# Altium project iono_pico.PrjPcb
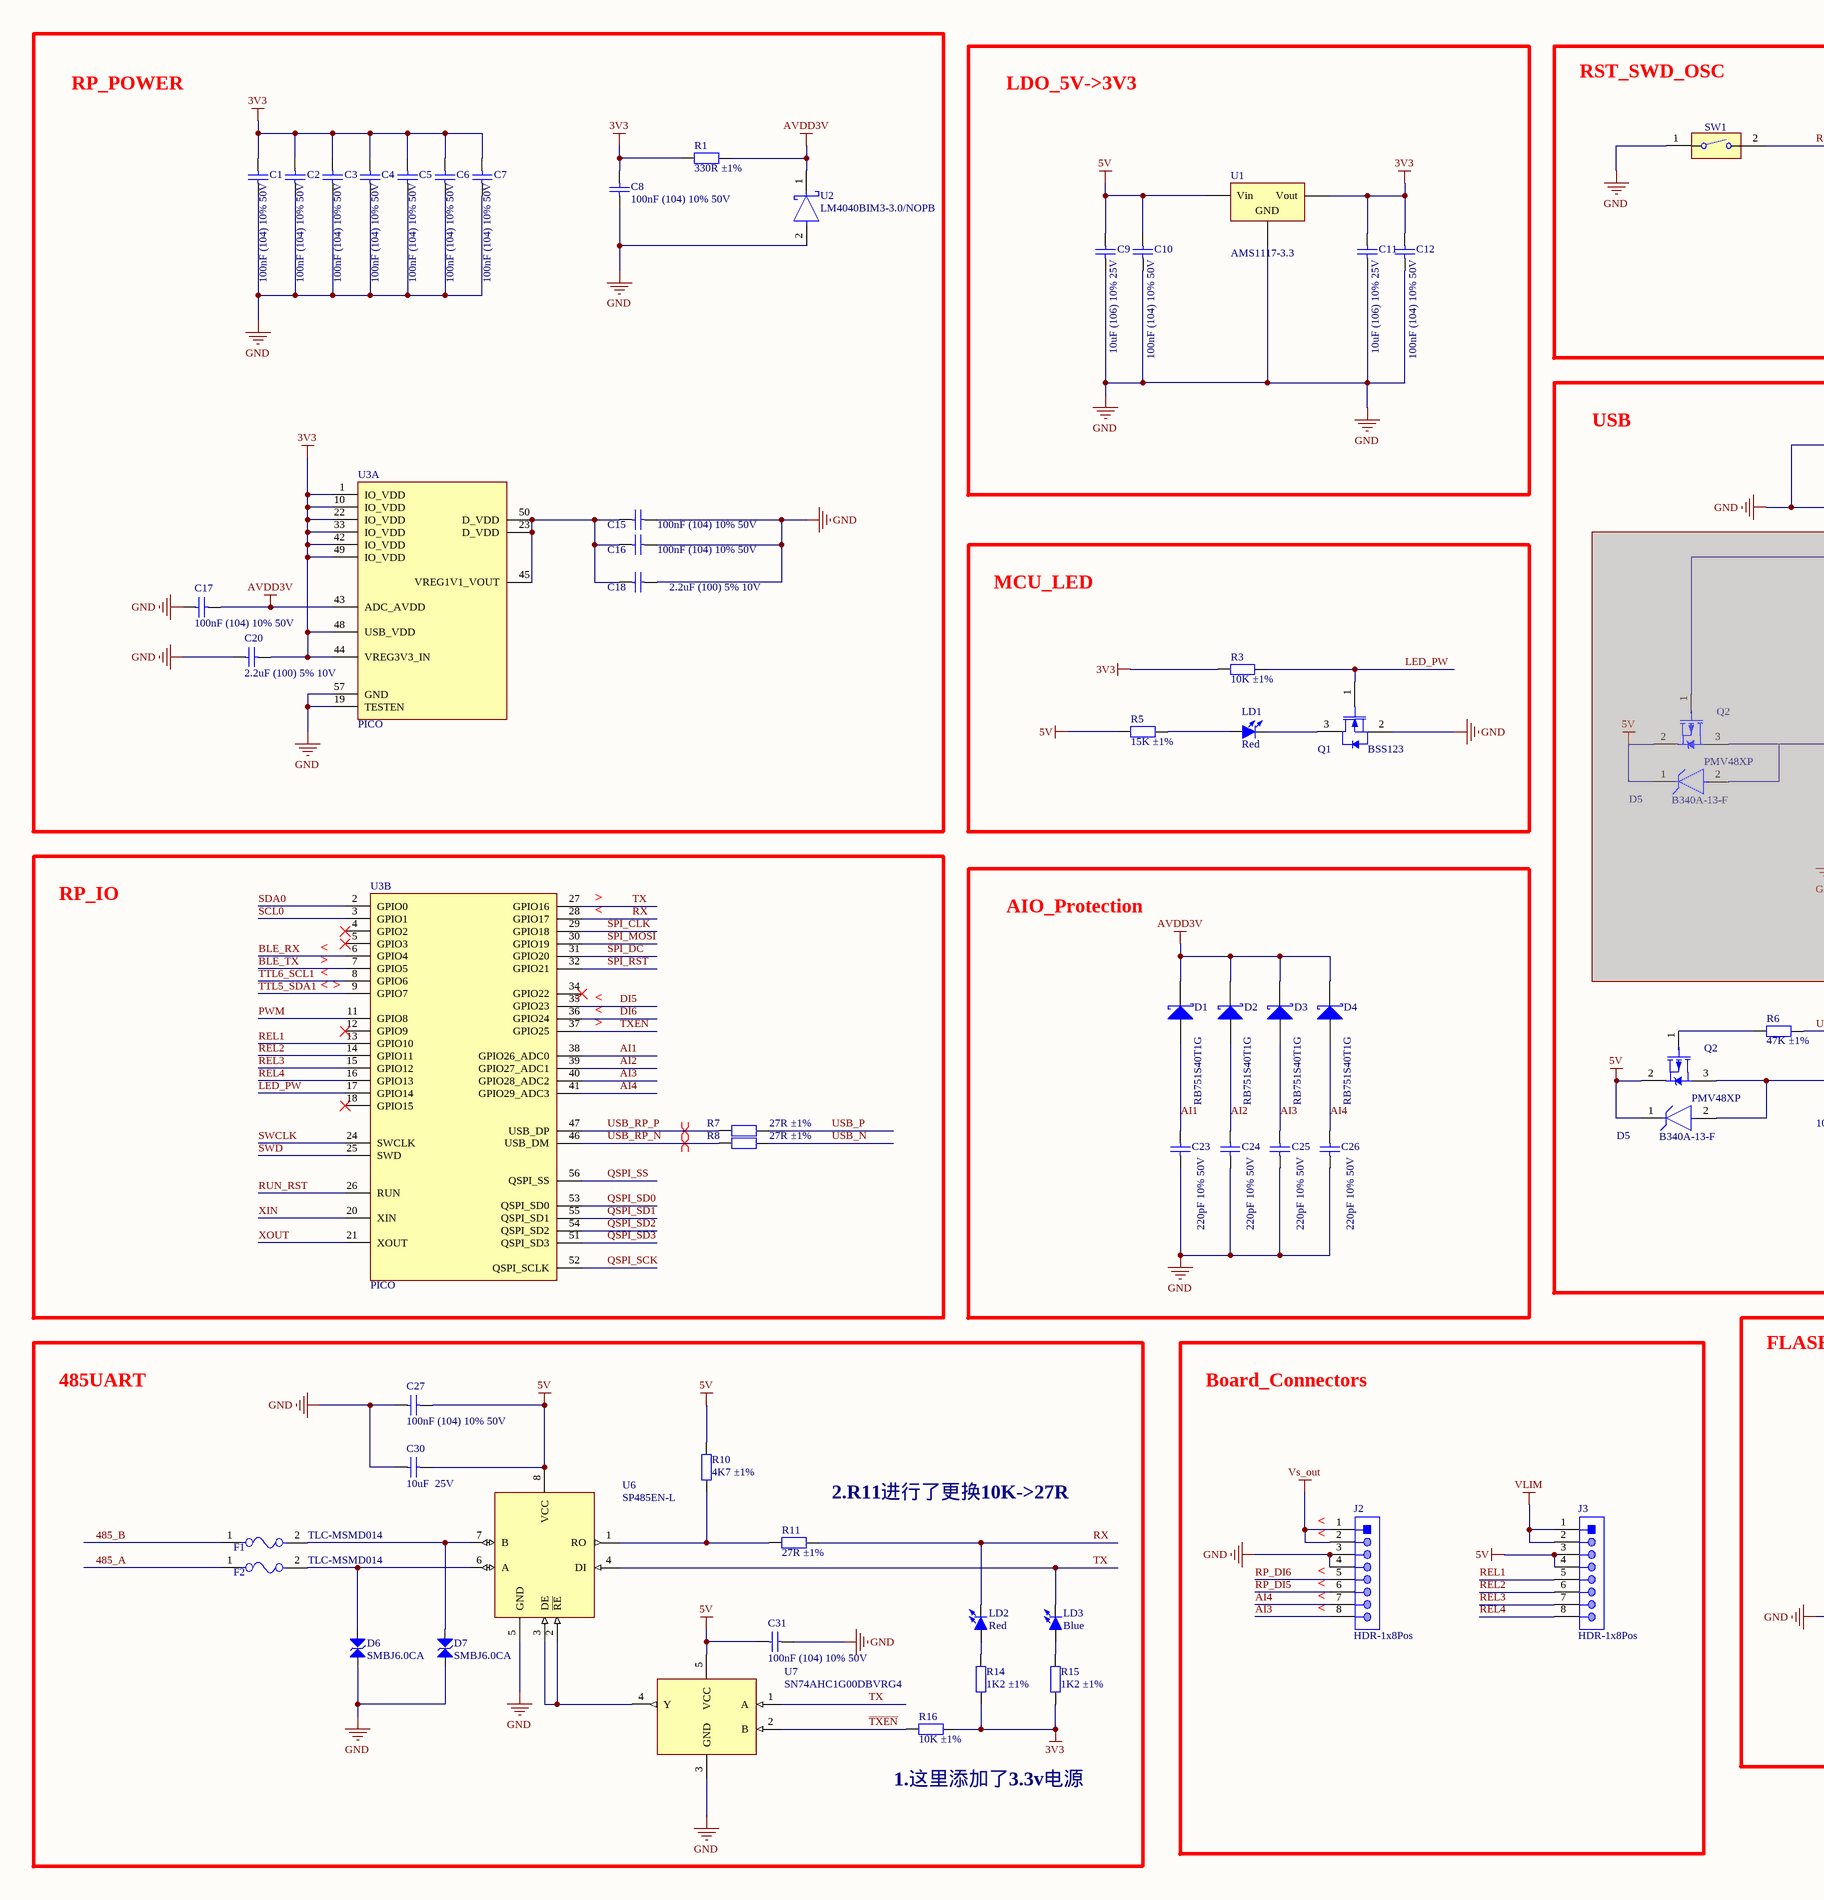
[diagram p0: core.SchDoc, left]
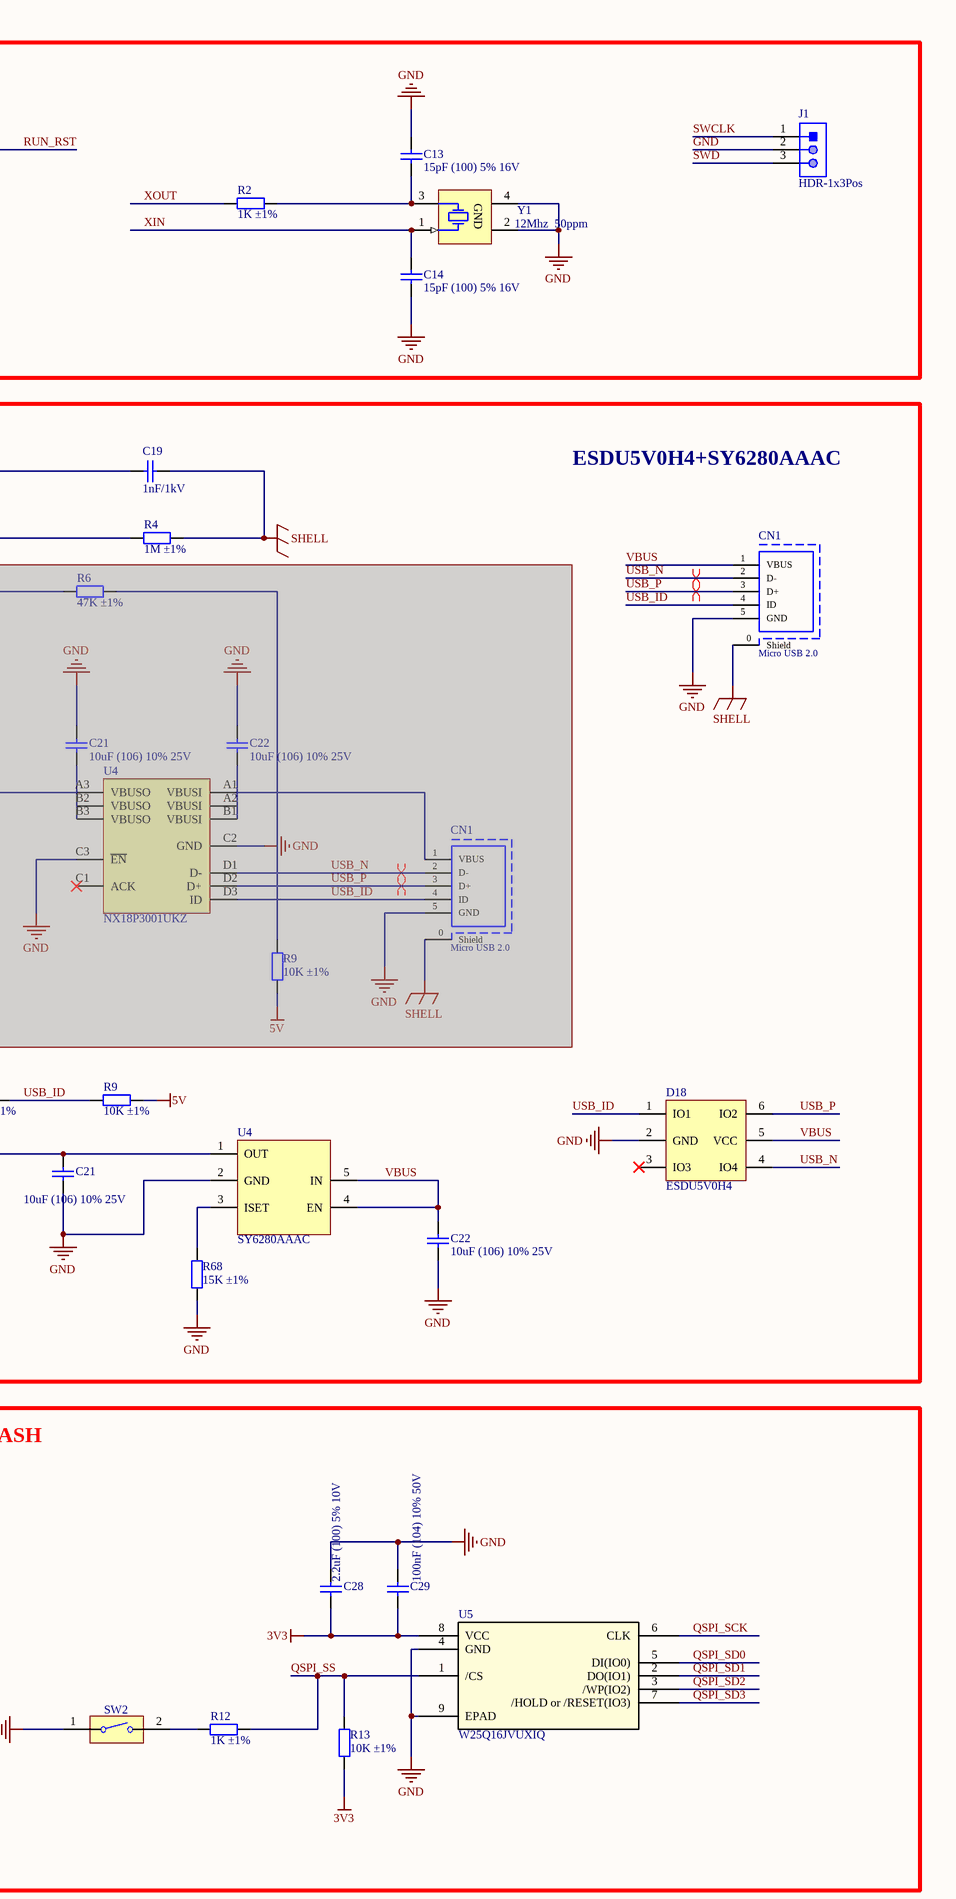
[diagram p1: core.SchDoc, right]
2 sheets, 183 parts. Net scope: global (net labels, ports and power ports of the same name join across sheets).
Board file: iono_pico.PcbDoc
Sheets:
  core.SchDoc
  device.SchDoc

## Sheet core.SchDoc
size A2

### Parts
(Parts that share a designator on the sheet are numbered #1, #2 ... from top to bottom, then left to right.)
C1  100nF (104) 10% 50V  [0402_C]
C2  100nF (104) 10% 50V  [0402_C]
C3  100nF (104) 10% 50V  [0402_C]
C4  100nF (104) 10% 50V  [0402_C]
C5  100nF (104) 10% 50V  [0402_C]
C6  100nF (104) 10% 50V  [0402_C]
C7  100nF (104) 10% 50V  [0402_C]
C8  100nF (104) 10% 50V  [0402_C]
C9  10uF (106) 10% 25V  [0603_C]
C10  100nF (104) 10% 50V  [0402_C]
C11  10uF (106) 10% 25V  [0603_C]
C12  100nF (104) 10% 50V  [0402_C]
C13  15pF (100) 5% 16V  [0402_C]
C14  15pF (100) 5% 16V  [0402_C]
C15  100nF (104) 10% 50V  [0402_C]
C16  100nF (104) 10% 50V  [0402_C]
C17  100nF (104) 10% 50V  [0402_C]
C18  2.2uF (100) 5% 10V  [0603_C]
C19  1nF/1kV  [0805_C]
C20  2.2uF (100) 5% 10V  [0603_C]
C21#1  10uF (106) 10% 25V  [0603_C]  (masked out: inside a compile mask, not in the netlist)
C21#2  10uF (106) 10% 25V  [0603_C]
C22#1  10uF (106) 10% 25V  [0603_C]  (masked out: inside a compile mask, not in the netlist)
C22#2  10uF (106) 10% 25V  [0603_C]
C23  220pF 10% 50V  [0402_C]
C24  220pF 10% 50V  [0402_C]
C25  220pF 10% 50V  [0402_C]
C26  220pF 10% 50V  [0402_C]
C27  100nF (104) 10% 50V  [0402_C]
C28  2.2uF (100) 5% 10V  [0603_C]
C29  100nF (104) 10% 50V  [0402_C]
C30  10uF  25V  [0603_C]
C31  100nF (104) 10% 50V  [0402_C]
CN1#1  Micro USB 2.0  [USB-MICRO-A]
CN1#2  Micro USB 2.0  [USB-MICRO-A]  (masked out: inside a compile mask, not in the netlist)
D1  RB751S40T1G  [SOD-523]
D2  RB751S40T1G  [SOD-523]
D3  RB751S40T1G  [SOD-523]
D4  RB751S40T1G  [SOD-523]
D5#1  B340A-13-F  [DO-214AC]  (masked out: inside a compile mask, not in the netlist)
D5#2  B340A-13-F  [DO-214AC]
D6  SMBJ6.0CA  [DO-214AA]
D7  SMBJ6.0CA  [DO-214AA]
D18  ESDU5V0H4  [SOT23-6]
F1  TLC-MSMD014  [1812_R]
F2  TLC-MSMD014  [1812_R]
J1  HDR-1x3Pos  [HDR-2.54-1x3-V]
J2  HDR-1x8Pos  [Pin Header 1x8 TH Pitch 2.54mm]
J3  HDR-1x8Pos  [Pin Header 1x8 TH Pitch 2.54mm]
LD1  Red  [0603_LED]
LD2  Red  [0603_LED]
LD3  Blue  [0603_LED]
Q1  BSS123  [SOT95P245X110-3N]
Q2#1  PMV48XP  [SOT-23-3]  (masked out: inside a compile mask, not in the netlist)
Q2#2  PMV48XP  [SOT-23-3]
R1  330R ±1%  [0402_R]
R2  1K ±1%  [0402_R]
R3  10K ±1%  [0402_R]
R4  1M ±1%  [0805_R]
R5  15K ±1%  [0402_R]
R6#1  47K ±1%  [0402_R]  (masked out: inside a compile mask, not in the netlist)
R6#2  47K ±1%  [0402_R]
R7  27R ±1%  [0402_R]
R8  27R ±1%  [0402_R]
R9#1  10K ±1%  [0402_R]  (masked out: inside a compile mask, not in the netlist)
R9#2  10K ±1%  [0402_R]
R10  4K7 ±1%  [0402_R]
R11  27R ±1%  [0402_R]
R12  1K ±1%  [0402_R]
R13  10K ±1%  [0402_R]
R14  1K2 ±1%  [0402_R]
R15  1K2 ±1%  [0402_R]
R16  10K ±1%  [0402_R]
R68  15K ±1%  [0402_R]
SW1  (no value)  [KEY-SMD_L6.1-W3.7-LS8.0]
SW2  (no value)  [KEY-SMD_L6.1-W3.7-LS8.0]
U1  AMS1117-3.3  [SOT-223]
U2  LM4040BIM3-3.0/NOPB  [SOT23]
U3  PICO  [RP2040]  (parts A,B of 2)
U4#1  NX18P3001UKZ  [WLCSP12]  (masked out: inside a compile mask, not in the netlist)
U4#2  SY6280AAAC  [SOT-23-5]
U5  W25Q16JVUXIQ  [W25Q16JVUXIQ_WIN]
U6  SP485EN-L  [SOIC8]
U7  SN74AHC1G00DBVRG4  [SOT-23-5]
Y1  12Mhz  50ppm  [OSC_SI-TIME_SIT1602-2]

### Blocks framed on the sheet
RP_POWER: C1-C8 C15-C18 C20 R1 U2 U3
LDO_5V->3V3: C9-C12 U1
RST_SWD_OSC: C13 C14 J1 R2 SW1 Y1
MCU_LED: LD1 Q1 R3 R5
RP_IO: R7 R8 U3
AIO_Protection: C23-C26 D1-D4
Board_Connectors: J2 J3
FLASH: C28 C29 R12 R13 SW2 U5

### Nets
3V3: C1.2 C2.2 C3.2 C4.2 C5.2 C6.2 C7.2 C8.2 C11.2 C12.2 C20.1 C28.2 C29.1 R1.1 R3.1 R13.1 R14.2 R15.2 R16.1 U1.2(Vout) U3.1(IO_VDD) U3.10(IO_VDD) U3.22(IO_VDD) U3.33(IO_VDD) U3.42(IO_VDD) U3.44(VREG3V3_IN) U3.48(USB_VDD) U3.49(IO_VDD) U5.8(VCC)
5V: C9.2 C10.2 C27.1 C30.2 C31.2 D5#2.1(C) J3.3 J3.4 Q2#2.2(S) R5.1 R9#2.1 R10.2 U1.3(Vin) U6.8(VCC) U7.5(VCC)
AVDD3V: C17.1 D1.1(K) D2.1(K) D3.1(K) D4.1(K) R1.2 U2.1 U3.43(ADC_AVDD)
GND: C1.1 C2.1 C3.1 C4.1 C5.1 C6.1 C7.1 C8.1 C9.1 C10.1 C11.1 C12.1 C13.2 C14.1 C15.2 C16.2 C17.2 C18.1 C19.1 C20.2 C21#2.1 C22#2.1 C23.1 C24.1 C25.1 C26.1 C27.2 C28.1 C29.2 C30.1 C31.1 CN1#1.5(GND) D6.2 D7.2 D18.2(GND) J1.2 J2.3 J2.4 Q1.2(SOURCE) R4.2 R68.1 SW1.1 SW2.1 U1.1(GND) U2.2 U3.19(TESTEN) U3.57(GND) U4#2.2(GND) U5.4(GND) U5.9(EPAD) U6.5(GND) U7.3(GND) Y1.2(GND) Y1.4(GND)
SHELL: C19.2 CN1#1.0(Shield) R4.1
VLIM: J3.1 J3.2
Vs_out: J2.1 J2.2
485_A: F2.1
485_B: F1.1
~{TXEN}: R16.2 U3.37(GPIO25) U7.2(B)
AI1: C23.2 D1.2(A) U3.38(GPIO26_ADC0)
AI2: C24.2 D2.2(A) U3.39(GPIO27_ADC1)
AI3: C25.2 D3.2(A) J2.8 U3.40(GPIO28_ADC2)
AI4: C26.2 D4.2(A) J2.7 U3.41(GPIO29_ADC3)
BLE_RX: U3.6(GPIO4)
BLE_TX: U3.7(GPIO5)
DI5: U3.35(GPIO23)
DI6: U3.36(GPIO24)
LED_PW: Q1.1(GATE) R3.2 U3.17(GPIO14)
PWM: U3.11(GPIO8)
QSPI_SCK: U3.52(QSPI_SCLK) U5.6(CLK)
QSPI_SD0: U3.53(QSPI_SD0) U5.5(DI(IO0))
QSPI_SD1: U3.55(QSPI_SD1) U5.2(DO(IO1))
QSPI_SD2: U3.54(QSPI_SD2) U5.3(/WP(IO2))
QSPI_SD3: U3.51(QSPI_SD3) U5.7(/HOLD_or_/RESET(IO3))
QSPI_SS: R12.1 R13.2 U3.56(QSPI_SS) U5.1(/CS)
REL1: J3.5 U3.13(GPIO10)
REL2: J3.6 U3.14(GPIO11)
REL3: J3.7 U3.15(GPIO12)
REL4: J3.8 U3.16(GPIO13)
RP_DI5: J2.6
RP_DI6: J2.5
RUN_RST: SW1.2 U3.26(RUN)
RX: LD2.2(K) R11.1 U3.28(GPIO17)
SCL0: U3.3(GPIO1)
SDA0: U3.2(GPIO0)
SPI_CLK: U3.29(GPIO18)
SPI_DC: U3.31(GPIO20)
SPI_MOSI: U3.30(GPIO19)
SPI_RST: U3.32(GPIO21)
SWCLK: J1.1 U3.24(SWCLK)
SWD: J1.3 U3.25(SWD)
TTL5_SDA1: U3.9(GPIO7)
TTL6_SCL1: U3.8(GPIO6)
TX: LD3.2(K) U3.27(GPIO16) U6.4(DI) U7.1(A)
USB_ID: CN1#1.4(ID) D18.1(IO1) R6#2.1 R9#2.2
USB_N: CN1#1.2(D-) D18.4(IO4) R8.2
USB_P: CN1#1.3(D+) D18.6(IO2) R7.2
USB_RP_N: R8.1 U3.46(USB_DM)
USB_RP_P: R7.1 U3.47(USB_DP)
VBUS: C22#2.2 CN1#1.1(VBUS) D18.5(VCC) U4#2.4(EN) U4#2.5(IN)
XIN: C14.2 U3.20(XIN) Y1.1(X)
XOUT: R2.1 U3.21(XOUT)
NetC13_1: C13.1 R2.2 Y1.3(X)
NetC15_1: C15.1 C16.1 C18.2 U3.23(D_VDD) U3.45(VREG1V1_VOUT) U3.50(D_VDD)
NetC21#2_2: C21#2.2 D5#2.2(A) Q2#2.3(D) U4#2.1(OUT)
NetD6_1: D6.1 F2.2 U6.6(A)
NetD7_1: D7.1 F1.2 U6.7(B)
NetLD1_1: LD1.1(A) R5.2
NetLD1_2: LD1.2(K) Q1.3(DRAIN)
NetLD2_1: LD2.1(A) R14.1
NetLD3_1: LD3.1(A) R15.1
NetQ2#2_1: Q2#2.1(G) R6#2.2
NetR10_1: R10.1 R11.2 U6.1(RO)
NetR12_2: R12.2 SW2.2
NetR68_2: R68.2 U4#2.3(ISET)
NetU6_2: U6.2(~{RE}) U6.3(DE) U7.4(Y)

Not connected (* = marked no-connect by the designer): D18 3(IO3)*; U3 4(GPIO2)* 5(GPIO3)* 12(GPIO9)* 18(GPIO15)* 34(GPIO22)*

### Layout directives
differential pair: (no net found under the mark), USB_N, USB_P, USB_RP_N, USB_RP_P

### Notes on the sheet
- USB
- ESDU5V0H4+SY6280AAAC
- (near U3) <
- (near U3) >
- 485UART
- (near R11) 2.R11进行了更换10K->27R
- (near J2) <
- (near R16) 1.这里添加了3.3v电源

### Library data of the parts
C1-C8 C10 C12 C15-C17 C27 C29 C31 = 0402 100nF (104) 10% 16V: 贴片电容; ComponentLink1Description: 供应商链接; ComponentLink1URL: http://www.szlcsc.com/product/details_1877.html; Package: 0402; Supplier: LC; SuppliersPartNumber: C1525
C9 C11 C21#1 C21#2 C22#1 C22#2 = 0603 10uF (106) 10% 10V: 贴片电容; ComponentLink1Description: 供应商链接; ComponentLink1URL: http://www.szlcsc.com/product/details_20411.html; Package: 0603; Supplier: LC; SuppliersPartNumber: C19702
C13 C14 = 0402 10pF (100) 5% 50V: 贴片电容; ComponentLink1Description: 供应商链接; ComponentLink1URL: http://www.szlcsc.com/product/details_33914.html; Package: 0402; Supplier: LC; SuppliersPartNumber: C32949
C18 C20 C28 C30 = 0603 10pF (100) 5% 50V: 贴片电容; ComponentLink1Description: 供应商链接; ComponentLink1URL: http://www.szlcsc.com/product/details_1986.html; Package: 0603; Supplier: LC; SuppliersPartNumber: C1634
C19 = 0603 1.5nF (152) 10% 50V: 贴片电容; ComponentLink1Description: 供应商链接; ComponentLink1URL: http://www.szlcsc.com/product/details_1947.html; Package: 0603; Supplier: LC; SuppliersPartNumber: C1595
C23-C26 = 0402 150pF (151) 10% 50V: 贴片电容; ComponentLink1Description: 供应商链接; ComponentLink1URL: http://www.szlcsc.com/product/details_1879.html; Package: 0402; Supplier: LC; SuppliersPartNumber: C1527
CN1#1 CN1#2 = Micro-USB2.0-2: Micro USB 2.0 Type AB Receptacle WR-COM, Horizontal, SMT; Part Number: 629105150921; Manufacturer: Wurth Elektronik; Rated Current: 1.8A; Contact Resistance: 30mOhm; Working Voltage: 30VAC; Publisher: WurthElektronik; Operating Temperature: -40to85degC; Gender: Receptacle; Packaging: TapeandReel; Connector Type: MicroUSB2.0TypeAB; Datasheet URL: https://katalog.we-online.de/em/datasheet/629105150921.pdf; Mounting Technology: SMT; Orientation: Horizontal; Package Reference: 629105150921; Manufacturer URL: http://www.we-online.de
D1-D4 = B230A-13-F: B230A-13-F,SCHOTTKY RECTIFIER; Manufacturer: Diodes; Element Configuration: Single; Max Repetitive Reverse Voltage (Vrrm): 30V; Forward Current: 2A; Peak Non-Repetitive Surge Current: 50A; Peak Reverse Current: 500uA; Forward Voltage: 500mV; Polarity: Standard; Capacitance: 200pF; Supplier 1: Digi-Key; Manufacturer Part Number: B230A-13-F; RoHS: Yes; Category: Rectifier Diodes; Stock 1: 36331; Pricing 1: 1=0.45000, 10=0.33900, 25=0.30560, 100=0.16110, 250=0.15944, 500=0.14276, 1000=0.11110, 2500=0.10166 (USD); Mount: Surface Mount; Case/Package: SMA; Number of Pins: 2; Weight: 0.002258oz; Contact Plating: Tin,Matte; Min Operating Temperature: -65°C; Max Operating Temperature: 150°C; Packaging: Tape and Reel; Current Rating: 2A; Max Forward Surge Current (Ifsm): 50A; Max Reverse Voltage (DC): 30V; Average Rectified Current: 2A; Output Current: 2A; Package Quantity: 5000; Termination: SMD/SMT; Voltage Rating (DC): 30V; Length: 4.6mm; Height: 2.1mm; Width: 2.92mm; Radiation Hardening: No; Lead Free: Lead Free; REACH SVHC: No SVHC; ComponentLink1URL: https://datasheet.ciiva.com/27052/1538769-27052351.pdf?src-supplier=Jameco; ComponentLink1Description: https://datasheet.ciiva.com/27052/1538769-27052351.pdf?src-supplier=Jameco; ComponentLink2URL: https://datasheet.ciiva.com/16289/ds13004-16289654.pdf?src-supplier=Future+Electronics; ComponentLink2Description: https://datasheet.ciiva.com/16289/ds13004-16289654.pdf?src-supplier=Future+Electronics; ComponentLink3URL: https://datasheet.ciiva.com/8301/ds13004-8301593.pdf?src-supplier=Avnet; ComponentLink3Description: https://datasheet.ciiva.com/8301/ds13004-8301593.pdf?src-supplier=Avnet; ComponentLink4URL: https://datasheet.ciiva.com/4715/ds13004-70120-4715546.pdf?src-supplier=Mouser; ComponentLink4Description: https://datasheet.ciiva.com/4715/ds13004-70120-4715546.pdf?src-supplier=Mouser; ComponentLink5URL: https://datasheet.ciiva.com/22695/1911814-22695786.pdf?src-supplier=Element14; ComponentLink5Description: https://datasheet.ciiva.com/22695/1911814-22695786.pdf?src-supplier=Element14; Supplier Part Number 1: B230A-FDICT-ND
D5#1 D5#2 = SMAJ16A: Transient Voltage Suppressor, 6.40 to 231 V, 16 V Stand-off Voltage, Uni-Directional, -55 to 155 degC, 2-pin DO-214AC, Pb-Free, Tape and Reel; PartNumber: SMAJ16A-E3/61; Manufacturer: Vishay Semiconductor; VBR Uni-Directional (V): 6.4 to 231; VWM (V): 16; ID (uA): 1; IFSM: 40 A; PPPM (W): 400, 300; Packing: Tape and Reel; Operating Junction and Storage Temperature Range: -55 to 150 degC; Mounting Technology: Surface Mount; DatasheetVersion: 12/8/2013; PackageReference: DO-214AC-2; PackageDescription: 2-Pin DO-214AC (SMA), Body 4.245 x 2.665 mm; ComponentLink1Description: Manufacturer URL; RoHS: TRUE; ComponentLink3URL: http://www.vishay.com/docs/88390/smaj50a.pdf; ComponentLink1URL: http://www.vishay.com/; ComponentLink3Description: Package Specification; ComponentLink2Description: Datasheet; ComponentLink2URL: http://www.vishay.com/docs/88390/smaj50a.pdf
D6 D7 = TBV05C: TVS,ESD二极管
D18 = ESDU5V0H4: USB ESD保护
F1 F2 = Fuse 2A 0805: 贴片保险，自恢复
J1 = HDR-1x3Pos: 2.54mm 排针
J2 J3 = HDR-1x8Pos: 2.54mm 排针
LD1-LD3 = LED: 贴片LED; 版权归属: 源创客; BOM名称: 贴片LED; 学习资源: www.ooocke.com
Q1 = 2N7002: Trans Mosfet N-ch 60V 0.115A 3-PIN SOT-23 T/r; Manufacturer: Infineon; Rds On Max: 3R; Continuous Drain Current (ID): 300mA; Input Capacitance: 13pF; Max Power Dissipation: 500mW; Element Configuration: Single; Drain to Source Resistance: 4R; Gate to Source Voltage (Vgs): 20V; Turn-Off Delay Time: 5.5ns; Turn-On Delay Time: 3ns; Supplier 1: Digi-Key; Manufacturer Part Number: 2N7002; RoHS: Yes; Category: MOSFETs; Stock 1: 36038; Pricing 1: 1=0.29000, 10=0.23500, 25=0.19720, 100=0.09640, 250=0.09484, 500=0.08038, 1000=0.05585 (USD); Case/Package: SOT-23; Number of Pins: 3; Min Operating Temperature: -55°C; Max Operating Temperature: 150°C; Packaging: Tape and Reel; Drain to Source Voltage (Vdss): 60V; Max Dual Supply Voltage: 60V; Length: 2.9mm; Height: 1mm; Width: 1.3mm; Halogen Free: Halogen Free; ComponentLink1URL: http://uk.rs-online.com/webdocs/1073/0900766b81073ec5.pdf?src-supplier=RSComponents; ComponentLink1Description: http://uk.rs-online.com/webdocs/1073/0900766b81073ec5.pdf?src-supplier=RSComponents; Supplier Part Number 1: 2N7002H6327XTSA2CT-ND
Q2#1 Q2#2 = PMV48XP: MOSFET P-CH -20 V -3.5 A
R1-R5 R6#1 R6#2 R7 R8 R9#1 R9#2 R12 R13 R68 = 0402 1.2KΩ (1201) 1%: 贴片电阻; ComponentLink1Description: 供应商链接; ComponentLink1URL: http://www.szlcsc.com/product/details_26605.html; Package: 0402; Supplier: LC; SuppliersPartNumber: C25862
R10 R11 R14-R16 = 0402 100KΩ (1003) 1%: 贴片电阻; ComponentLink1Description: 供应商链接; ComponentLink1URL: http://www.szlcsc.com/product/details_26484.html; Package: 0402; Supplier: LC; SuppliersPartNumber: C25741
SW1 SW2 = SW 1x SPST DIP Switch: 1 Ways SPST DIP Switch
U1 = AMS1117-3.3: 低压差线性稳压(LDO); ComponentLink1Description: 供应商链接; ComponentLink1URL: http://www.szlcsc.com/product/details_6652.html; Package: SOT-223; Supplier: LC; SuppliersPartNumber: C6186
U2 = LM4040BIM3-3.0/NOPB: 电压基准，输出类型：固定 输出电压：3V 输出电流：15mA 精度：±0.1% 温度系数：100ppm/℃ 最小阴极电流调节：67μA 工作温度：-40℃~+85℃@(TA)
U3 = RP2040: 树莓派RP2040单片机
U4#1 = NX18P3001UKZ: USB保护开关，ESD器件
U4#2 = SY6280AAAC: USB电子开关，电流保护
U5 = W25Q16JVUXIQ: NOR快闪spiFlash, 3V, 16M-bit, 4Kb Uniform Sector, DTR, USON-8; Mfr_Name: Winbond; Copyright: Copyright (C) 2022 Ultra Librarian. All rights reserved.; Manufacturer_Part_Number: W25Q16JVUXIQ; RefDes: RefDes; Type: DEV
U6 = SP485EN-L: Enhanced Low Power Half-Duplex RS-485 Transceivers; MF: {'manufacturer': u'MaxLinear, Inc.'}; Availability: Unavailable; Price: None; Package: None; Value: *; MP: SP485EN-L
U7 = SN74AHC1G00DBVRG4: 与非门; MF: {'manufacturer': u'Texas Instruments'}; Availability: Unavailable; Price: None; Package: None; Value: *; MP: SN74AHC1G00DBVRG4
Y1 = Quartz Crystal 1X 2GND 3X 4GND: 贴片晶振 Crystal 4 pins 1=XTAL Control 2=GND3=XTAL 4=GND

## Sheet device.SchDoc
size A2
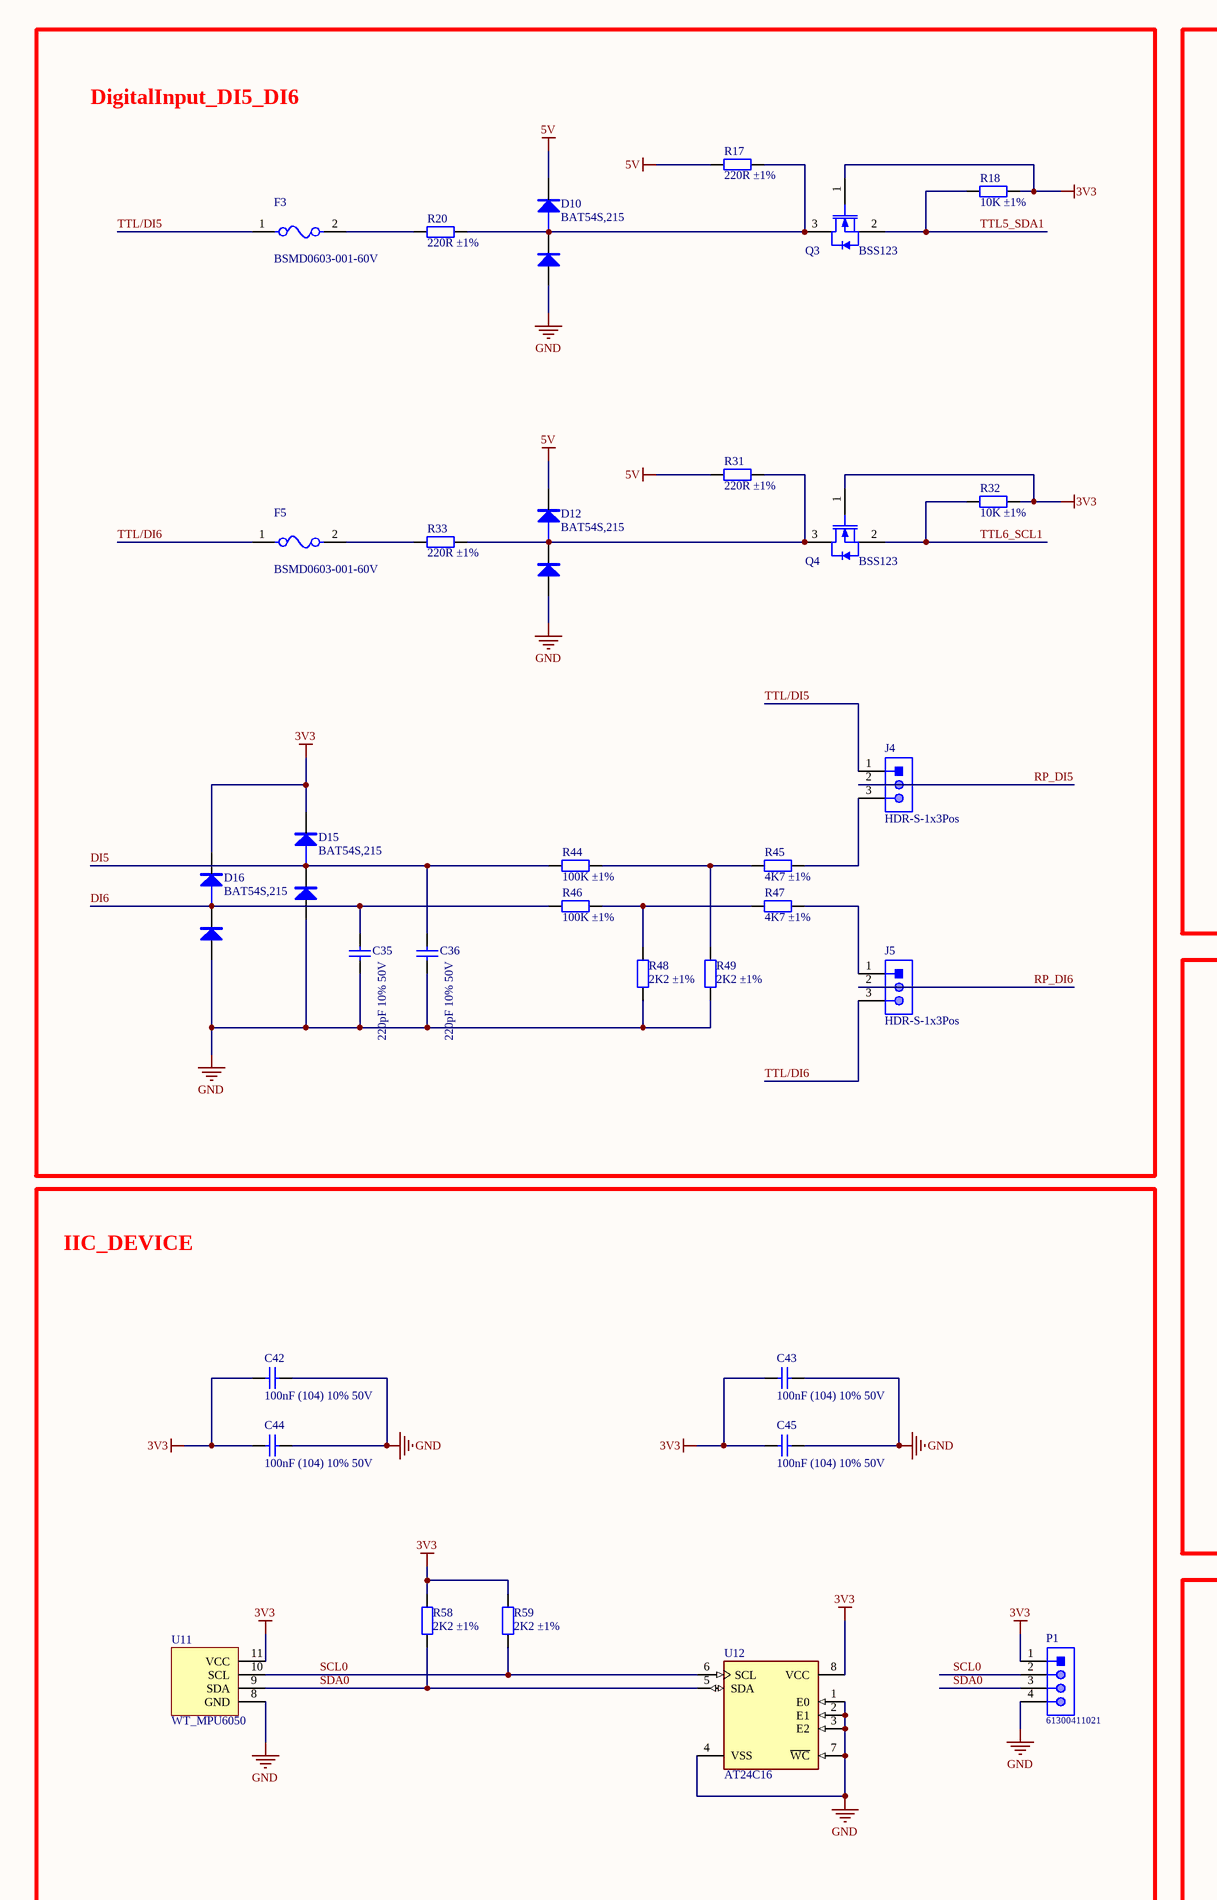
[diagram p2: device.SchDoc, left]
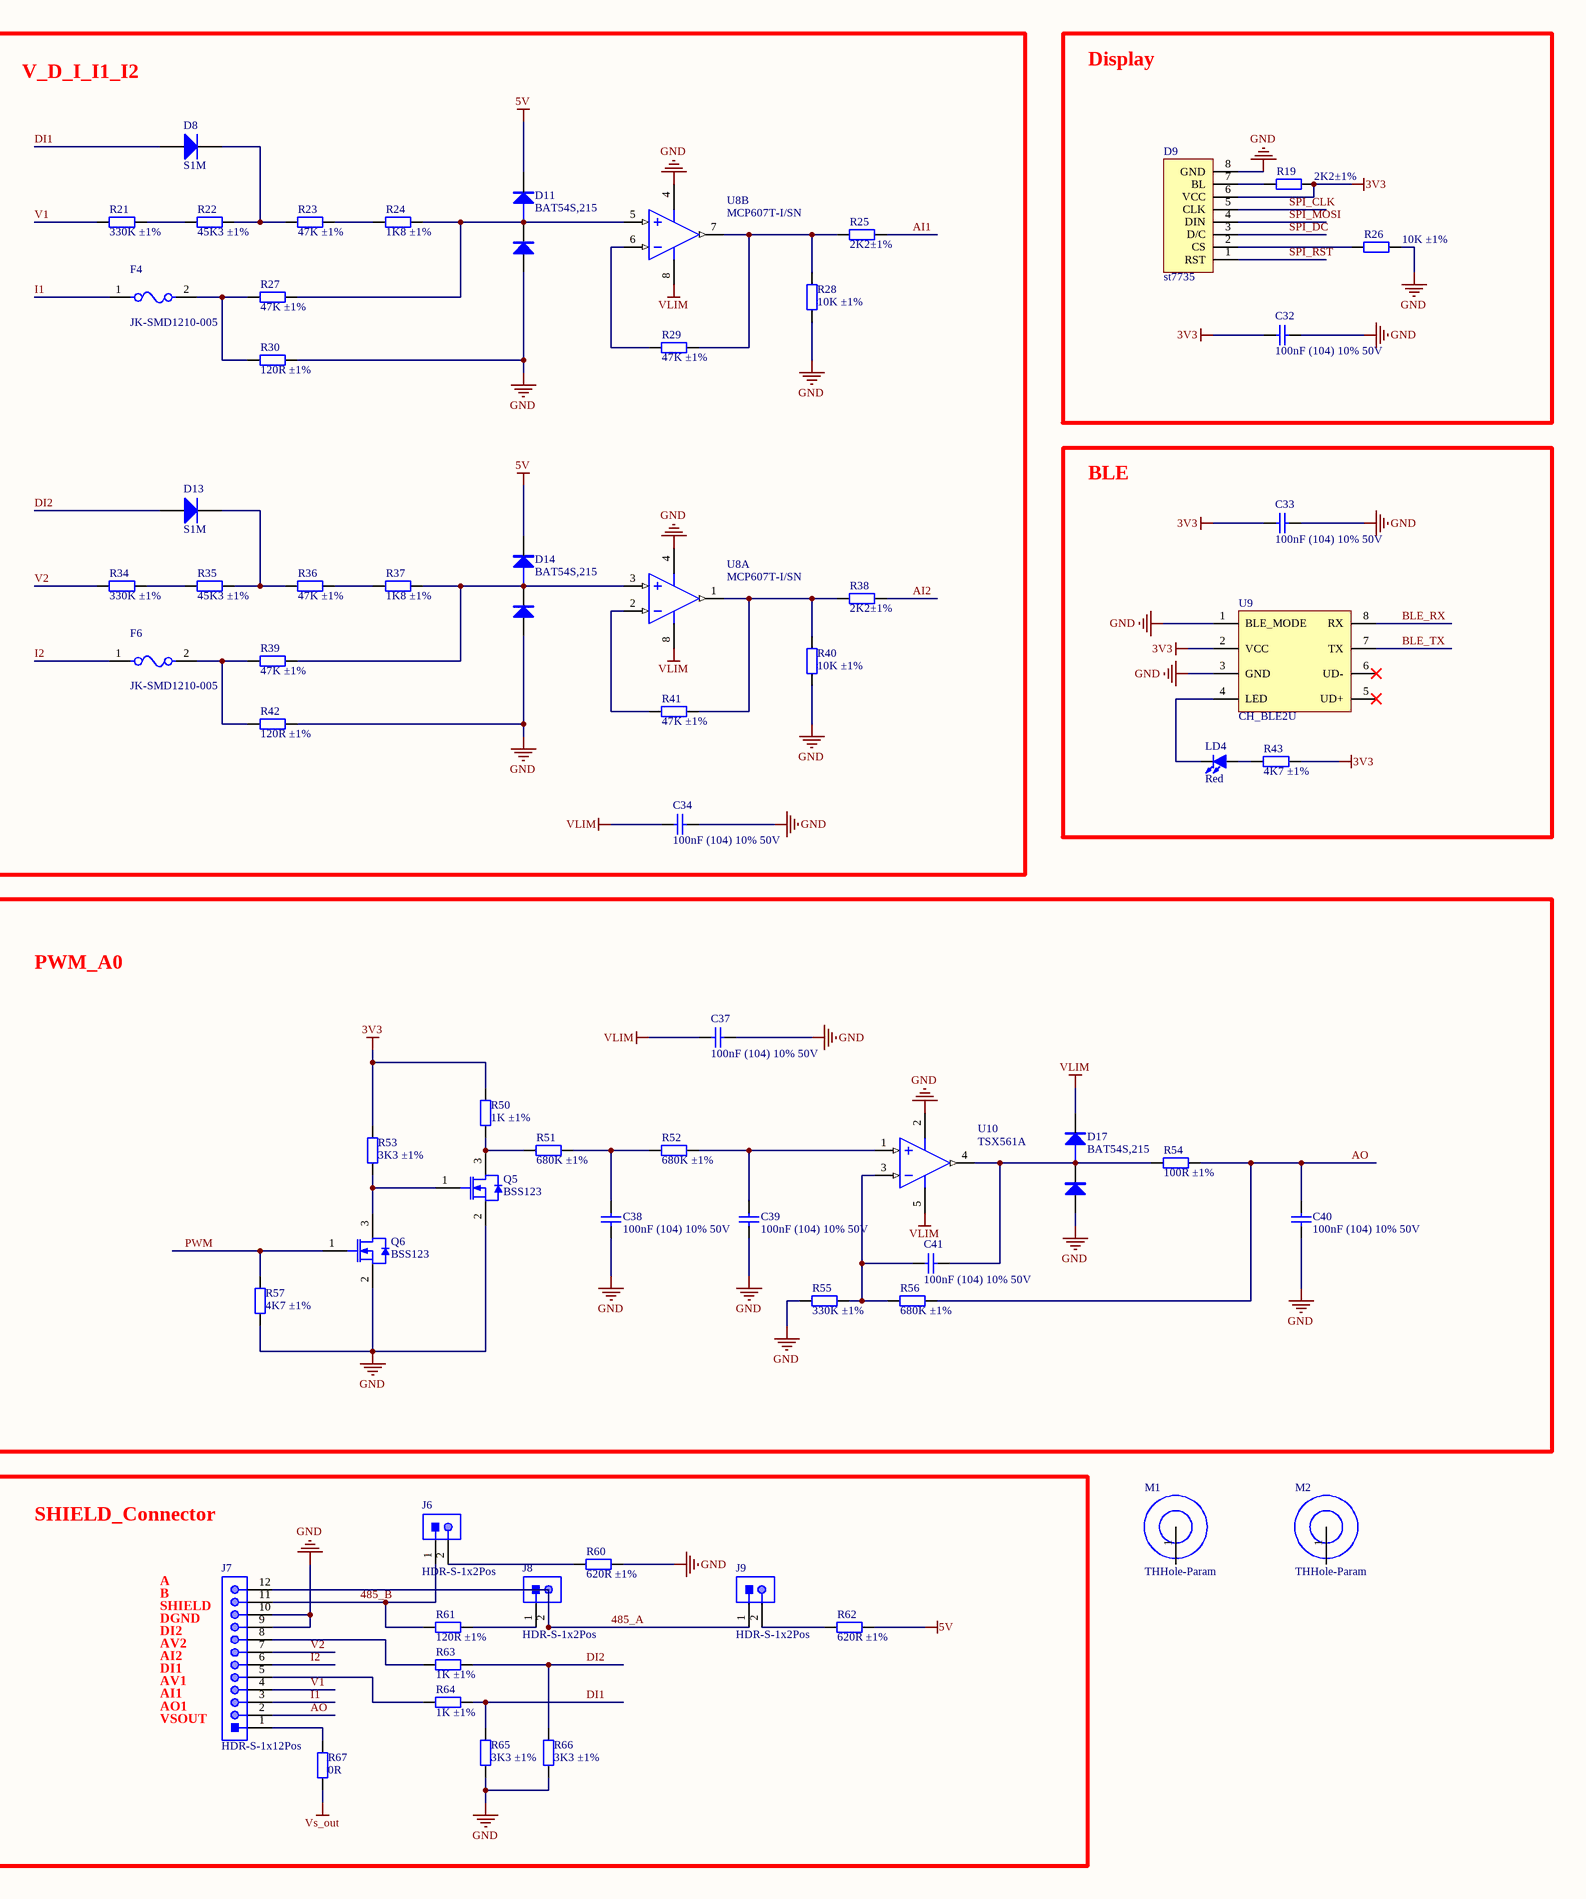
[diagram p3: device.SchDoc, right]

### Parts
C32  100nF (104) 10% 50V  [0402_C]
C33  100nF (104) 10% 50V  [0402_C]
C34  100nF (104) 10% 50V  [0402_C]
C35  220pF 10% 50V  [0402_C]
C36  220pF 10% 50V  [0402_C]
C37  100nF (104) 10% 50V  [0402_C]
C38  100nF (104) 10% 50V  [0402_C]
C39  100nF (104) 10% 50V  [0402_C]
C40  100nF (104) 10% 50V  [0402_C]
C41  100nF (104) 10% 50V  [0402_C]
C42  100nF (104) 10% 50V  [0402_C]
C43  100nF (104) 10% 50V  [0402_C]
C44  100nF (104) 10% 50V  [0402_C]
C45  100nF (104) 10% 50V  [0402_C]
D8  S1M  [DO-214AC]
D9  st7735  [HX-2.54-F-1x8-V]
D10  BAT54S,215  [SOT-23-3]
D11  BAT54S,215  [SOT-23-3]
D12  BAT54S,215  [SOT-23-3]
D13  S1M  [DO-214AC]
D14  BAT54S,215  [SOT-23-3]
D15  BAT54S,215  [SOT-23-3]
D16  BAT54S,215  [SOT-23-3]
D17  BAT54S,215  [SOT-23-3]
F3  BSMD0603-001-60V  [FU 0805]
F4  JK-SMD1210-005  [1210_R]
F5  BSMD0603-001-60V  [FU 0805]
F6  JK-SMD1210-005  [1210_R]
J4  HDR-S-1x3Pos  [HX-2.54-F-1x3-V]
J5  HDR-S-1x3Pos  [HX-2.54-F-1x3-V]
J6  HDR-S-1x2Pos  [Pin Header 1x2 TH Pitch 2.54mm]
J7  HDR-S-1x12Pos  [KF2EDGK-2.54-WI-12P]
J8  HDR-S-1x2Pos  [Pin Header 1x2 TH Pitch 2.54mm]
J9  HDR-S-1x2Pos  [Pin Header 1x2 TH Pitch 2.54mm]
LD4  Red  [0603_LED]
M1  THHole-Param  [MTG300_600]
M2  THHole-Param  [MTG300_600]
P1  61300411021  [HDR-2.54-1x4-H]
Q3  BSS123  [SOT95P245X110-3N]
Q4  BSS123  [SOT95P245X110-3N]
Q5  BSS123  [SOT95P245X110-3N]
Q6  BSS123  [SOT95P245X110-3N]
R17  220R ±1%  [0402_R]
R18  10K ±1%  [0402_R]
R19  2K2±1%  [0402_R]
R20  220R ±1%  [0402_R]
R21  330K ±1%  [0402_R]
R22  45K3 ±1%  [0402_R]
R23  47K ±1%  [0402_R]
R24  1K8 ±1%  [0402_R]
R25  2K2±1%  [0402_R]
R26  10K ±1%  [0402_R]
R27  47K ±1%  [0402_R]
R28  10K ±1%  [0402_R]
R29  47K ±1%  [0402_R]
R30  120R ±1%  [RS 1/4W-V3]
R31  220R ±1%  [0402_R]
R32  10K ±1%  [0402_R]
R33  220R ±1%  [0402_R]
R34  330K ±1%  [0402_R]
R35  45K3 ±1%  [0402_R]
R36  47K ±1%  [0402_R]
R37  1K8 ±1%  [0402_R]
R38  2K2±1%  [0402_R]
R39  47K ±1%  [0402_R]
R40  10K ±1%  [0402_R]
R41  47K ±1%  [0402_R]
R42  120R ±1%  [RS 1/4W-V3]
R43  4K7 ±1%  [0402_R]
R44  100K ±1%  [0402_R]
R45  4K7 ±1%  [0402_R]
R46  100K ±1%  [0402_R]
R47  4K7 ±1%  [0402_R]
R48  2K2 ±1%  [0402_R]
R49  2K2 ±1%  [0402_R]
R50  1K ±1%  [0402_R]
R51  680K ±1%  [0402_R]
R52  680K ±1%  [0402_R]
R53  3K3 ±1%  [0402_R]
R54  100R ±1%  [0603_R]
R55  330K ±1%  [0603_R]
R56  680K ±1%  [0603_R]
R57  4K7 ±1%  [0402_R]
R58  2K2 ±1%  [0402_R]
R59  2K2 ±1%  [0402_R]
R60  620R ±1%  [0603_R]
R61  120R ±1%  [0603_R]
R62  620R ±1%  [0603_R]
R63  1K ±1%  [0402_R]
R64  1K ±1%  [0402_R]
R65  3K3 ±1%  [0402_R]
R66  3K3 ±1%  [0402_R]
R67  0R  [1210_R]
U8  MCP607T-I/SN  [D0008A_L]  (parts A,B of 2)
U9  CH_BLE2U  [CH_BLE2U]
U10  TSX561A  [SOT-23-5]
U11  WT_MPU6050  [WT_MPU6050]
U12  AT24C16  [FP-SO8N-SO-A-IPC_A]

### Blocks framed on the sheet
DigitalInput_DI5_DI6: C35 C36 D10 D12 D15 D16 F3 F5 J4 J5 Q3 Q4 R17 R18 R20 R31-R33 R44-R49
V_D_I_I1_I2: C34 D8 D11 D13 D14 F4 F6 R21-R25 R27-R30 R34-R42 U8
Display: C32 D9 R19 R26
BLE: C33 LD4 R43 U9
PWM_A0: C37-C41 D17 Q5 Q6 R50-R57 U10
IIC_DEVICE: C42-C45 P1 R58 R59 U11 U12
SHIELD_Connector: J6-J9 R60-R67

### Nets
3V3: C32.1 C33.1 C42.1 C43.1 C44.1 C45.1 D9.6(VCC) D15.2 D16.2 P1.1 Q3.1(GATE) Q4.1(GATE) R18.1 R19.2 R32.1 R43.2 R50.1 R53.1 R58.1 R59.1 U9.2(VCC) U11.11(VCC) U12.8(VCC)
5V: D10.2 D11.2 D12.2 D14.2 R17.1 R31.1 R62.2
GND: C32.2 C33.2 C34.2 C35.1 C36.1 C37.2 C38.1 C39.1 C40.2 C42.2 C43.2 C44.2 C45.2 D9.8(GND) D10.1 D11.1 D12.1 D14.1 D15.1 D16.1 D17.1 J7.9 J7.10 P1.4 Q5.2(SOURCE) Q6.2(SOURCE) R26.2 R28.2 R30.1 R40.2 R42.1 R48.2 R49.2 R55.1 R57.2 R60.2 R65.1 R66.1 U8.4(GND) U9.1(BLE_MODE) U9.3(GND) U10.2(GND) U11.8(GND) U12.1(E0) U12.2(E1) U12.3(E2) U12.4(VSS) U12.7(~{WC})
VLIM: C34.1 C37.1 D17.2 U8.8(VCC) U10.5(VCC)
Vs_out: R67.1
485_A: J7.12 J8.2 J9.1
485_B: J6.1 J7.11 R61.1
AI1: R25.2
AI2: R38.2
AO: C40.1 J7.2 R54.2 R56.2
BLE_RX: U9.8(RX)
BLE_TX: U9.7(TX)
DI1: D8.2(A) R64.2 R65.2
DI2: D13.2(A) R63.2 R66.2
DI5: C36.2 D15.3 R44.1
DI6: C35.2 D16.3 R46.1
I1: F4.1 J7.3
I2: F6.1 J7.6
PWM: Q6.1(GATE) R57.1
RP_DI5: J4.2
RP_DI6: J5.2
SCL0: P1.2 R59.2 U11.10(SCL) U12.6(SCL)
SDA0: P1.3 R58.2 U11.9(SDA) U12.5(SDA)
SPI_CLK: D9.5(CLK)
SPI_DC: D9.3(D/C)
SPI_MOSI: D9.4(DIN)
SPI_RST: D9.1(RST)
TTL5_SDA1: Q3.2(SOURCE) R18.2
TTL6_SCL1: Q4.2(SOURCE) R32.2
TTL/DI5: F3.1 J4.1
TTL/DI6: F5.1 J5.3
V1: J7.4 R21.2
V2: J7.7 R34.2
NetC38_2: C38.2 R51.2 R52.1
NetC39_2: C39.2 R52.2 U10.1(IN+)
NetC41_1: C41.1 D17.3 R54.1 U10.4(OUT)
NetC41_2: C41.2 R55.2 R56.1 U10.3(IN-)
NetD8_1: D8.1(K) R22.1 R23.2
NetD9_2: D9.2(CS) R26.1
NetD9_7: D9.7(BL) R19.1
NetD10_3: D10.3 Q3.3(DRAIN) R17.2 R20.2
NetD11_3: D11.3 R24.1 R27.1 U8.5(2IN+)
NetD12_3: D12.3 Q4.3(DRAIN) R31.2 R33.2
NetD13_1: D13.1(K) R35.1 R36.2
NetD14_3: D14.3 R37.1 R39.1 U8.3(1IN+)
NetF3_2: F3.2 R20.1
NetF4_2: F4.2 R27.2 R30.2
NetF5_2: F5.2 R33.1
NetF6_2: F6.2 R39.2 R42.2
NetJ4_3: J4.3 R45.2
NetJ5_1: J5.1 R47.2
NetJ6_2: J6.2 R60.1
NetJ7_1: J7.1 R67.2
NetJ7_5: J7.5 R64.1
NetJ7_8: J7.8 R63.1
NetJ8_1: J8.1 R61.2
NetJ9_2: J9.2 R62.1
NetLD4_1: LD4.1(A) R43.1
NetLD4_2: LD4.2(K) U9.4(LED)
NetQ5_1: Q5.1(GATE) Q6.3(DRAIN) R53.2
NetQ5_3: Q5.3(DRAIN) R50.2 R51.1
NetR21_1: R21.1 R22.2
NetR23_1: R23.1 R24.2
NetR25_1: R25.1 R28.1 R29.1 U8.7(2OUT)
NetR29_2: R29.2 U8.6(2IN-)
NetR34_1: R34.1 R35.2
NetR36_1: R36.1 R37.2
NetR38_1: R38.1 R40.1 R41.1 U8.1(1OUT)
NetR41_2: R41.2 U8.2(1IN-)
NetR44_2: R44.2 R45.1 R49.1
NetR46_2: R46.2 R47.1 R48.1

Not connected (* = marked no-connect by the designer): M1 1; M2 1; U9 5(UD+)* 6(UD-)*

### Notes on the sheet
- A
- B
- (near J7) SHIELD
- DGND
- DI2
- AV2
- AI2
- DI1
- AV1
- AI1
- AO1
- VSOUT

### Library data of the parts
C32-C34 C37-C45 = 0402 100nF (104) 10% 16V: 贴片电容; ComponentLink1Description: 供应商链接; ComponentLink1URL: http://www.szlcsc.com/product/details_1877.html; Package: 0402; Supplier: LC; SuppliersPartNumber: C1525
C35 C36 = 0402 150pF (151) 10% 50V: 贴片电容; ComponentLink1Description: 供应商链接; ComponentLink1URL: http://www.szlcsc.com/product/details_1879.html; Package: 0402; Supplier: LC; SuppliersPartNumber: C1527
D8 D13 = B5817WS-TP: 肖特基二极管; Manufacturer: MCC; Forward Voltage: 450mV; Max Reverse Current: 1mA; Average Rectified Current: 1A; Max Repetitive Reverse Voltage (Vrrm): 20V; Max Forward Surge Current (Ifsm): 10A; Element Configuration: Single; Supplier 1: Digi-Key; Manufacturer Part Number: B5817WS-TP; RoHS: Yes; Category: Rectifier Diodes; Stock 1: 47317; Pricing 1: 1=0.43000, 10=0.30300, 100=0.15310, 500=0.12486, 1000=0.09264 (USD); Mount: Surface Mount; Number of Pins: 2; Max Operating Temperature: 125°C; Packaging: Tape and Reel; Package Quantity: 1; Forward Current: 1A; Max Reverse Voltage (DC): 20V; REACH SVHC: Unknown; Lead Free: Lead Free; RoHS Compliant: Yes; ComponentLink1URL: https://datasheet.ciiva.com/912/b5817ws-b5819wssod-323-912713.pdf?src-supplier=Digi-Key; ComponentLink1Description: https://datasheet.ciiva.com/912/b5817ws-b5819wssod-323-912713.pdf?src-supplier=Digi-Key; ComponentLink2URL: https://datasheet.ciiva.com/7624/b5817ws-b5819wssod-323-7624698.pdf?src-supplier=Element14; ComponentLink2Description: https://datasheet.ciiva.com/7624/b5817ws-b5819wssod-323-7624698.pdf?src-supplier=Element14; ComponentLink3URL: https://datasheet.ciiva.com/912/b5817ws-b5819wssod-323-912711.pdf?src-supplier=Digi-Key; ComponentLink3Description: https://datasheet.ciiva.com/912/b5817ws-b5819wssod-323-912711.pdf?src-supplier=Digi-Key; ComponentLink4URL: https://datasheet.ciiva.com/912/b5817ws-b5819wssod-323-912712.pdf?src-supplier=Digi-Key; ComponentLink4Description: https://datasheet.ciiva.com/912/b5817ws-b5819wssod-323-912712.pdf?src-supplier=Digi-Key; ComponentLink5URL: https://datasheet.ciiva.com/17182/b5817ws-b5819wssod-323-17182367.pdf?src-supplier=Future+Electronics; ComponentLink5Description: https://datasheet.ciiva.com/17182/b5817ws-b5819wssod-323-17182367.pdf?src-supplier=Future+Electronics; Supplier Part Number 1: B5817WS-TPMSCT-ND
D10-D12 D14-D17 = BAT54S,215: 肖特基二极管
F3-F6 = Fuse 2A 0805: 贴片保险，自恢复
J4 J5 = HDR-S-1x3Pos: 2.54mm 排座
J6 J8 J9 = HDR-S-1x2Pos: 2.54mm 排座
J7 = HDR-S-1x12Pos: 2.54mm 排座
LD4 = LED: 贴片LED; 版权归属: 源创客; BOM名称: 贴片LED; 学习资源: www.ooocke.com
M1 M2 = MHole-1: 金属化可接地固定孔
P1 = HDR-1x4Pos: 2.54mm 排针; Manufacturer: Wurth Elektronik; Gender: Male; Pin Number: 4; Withstanding Voltage: 500VAC; Row Number: Single; Working Voltage: 250VAC; Contact Resistance: 20mOhm; Rated Current: 3A; Manufacturer URL: http://www.we-online.de; Mounting Technology: THT; Publisher: WurthElektronik; Operating Temperature: -40to105degC; Packaging: Bag; Package Reference: 61300411021; Part Number: 61300411021; Orientation: Angled; Pitch: 2.54mm; Datasheet URL: https://katalog.we-online.de/em/datasheet/6130xx11021.pdf
Q3-Q6 = 2N7002: as Q1 on sheet core; Supplier 1: Digi-Key; Manufacturer Part Number: 2N7002; RoHS: Yes; Category: MOSFETs; Stock 1: 36038; Pricing 1: 1=0.29000, 10=0.23500, 25=0.19720, 100=0.09640, 250=0.09484, 500=0.08038, 1000=0.05585 (USD); Case/Package: SOT-23; Number of Pins: 3; Min Operating Temperature: -55°C; Max Operating Temperature: 150°C; Packaging: Tape and Reel; Drain to Source Voltage (Vdss): 60V; Max Dual Supply Voltage: 60V; Length: 2.9mm; Height: 1mm; Width: 1.3mm; Halogen Free: Halogen Free; ComponentLink1URL: http://uk.rs-online.com/webdocs/1073/0900766b81073ec5.pdf?src-supplier=RSComponents; ComponentLink1Description: http://uk.rs-online.com/webdocs/1073/0900766b81073ec5.pdf?src-supplier=RSComponents; Supplier Part Number 1: 2N7002H6327XTSA2CT-ND
R17-R42 R44-R67 = 0402 1.2KΩ (1201) 1%: 贴片电阻; ComponentLink1Description: 供应商链接; ComponentLink1URL: http://www.szlcsc.com/product/details_26605.html; Package: 0402; Supplier: LC; SuppliersPartNumber: C25862
R43 = 0402 100KΩ (1003) 1%: 贴片电阻; ComponentLink1Description: 供应商链接; ComponentLink1URL: http://www.szlcsc.com/product/details_26484.html; Package: 0402; Supplier: LC; SuppliersPartNumber: C25741
U8 = TI-LM358DR: Dual Operational Amplifier, 3 to 32 V, 0 to 70 degC, 8-Pin SOIC (D), Green (RoHS & no Sb/Br), Tape and Reel; DatasheetVersion: SLOS068T, 04/2015; ComponentLink1URL: http://www.ti.com/; ComponentLink2URL: http://www.ti.com/lit/ds/symlink/lm358.pdf; ComponentLink3Description: Package Specification; Code_JEDEC: MS-012; PackageDescription: 8-Pin Small Outline Integrated Circuit, Body 4.9 x 3.9 mm, Pitch 1.27 mm; ComponentLink2Description: Datasheet; PackageVersion: 4040047-3/M, 06/2011; ComponentLink1Description: Manufacturer URL; ComponentLink3URL: http://www.ti.com/lit/ml/msoi002j/msoi002j.pdf; PackageReference: D0008A
U9 = CH_BLE2U: BLE模块
U12 = ST-M24C02-WMN6TP: IC EEPROM 2K I2C 400KHZ 8SO; Manufacturer: STMicroelectronics; Min Supply Voltage: 2.5V; Standoff Height: 0.1mm; Nominal Supply Current: 0.5-1mA; Access Time: 900ns; Memory Size: 2Kbits; Max Supply Voltage: 5.5V; Digikey Description: IC EEPROM 2K I2C 400KHZ 8SO; Memory Type: EEPROM; ComponentLink2URL: https://www.st.com/resource/en/datasheet/m24c02-w.pdf; Device Class L3: EEPROM; Interface: I2C; Temperature Range High: +85°C; Mouser Description: M24C02 Series 2 Kb (256 x 8) 2.5 V SMT Serial I²C Bus EEPROM - SOIC-8; RoHS: TRUE; Lead Free: Yes; Ambient Temperature Range Low: -40°C; Temperature: -40°C to +85°C; Device Class L1: Integrated Circuits (ICs); Temperature Range Low: -40°C; Frequency: 400kHz; Category: IC; Manufacturer Part Number: M24C02-WMN6TP; Height: 1.75mm; Octopart: https://octopart.com/m24c02-wmn6tp-stmicroelectronics-55404516; Automotive: No; Ambient Temperature Range High: +85°C; ComponentLink2Description: Datasheet; Package: SO8N-SO-A; Device Class L2: Memory

## Nets that join several sheets
3V3: core (29 pins), device (23 pins)
5V: core (15 pins), device (7 pins)
GND: core (54 pins), device (48 pins)
VLIM: core (J3.1 J3.2), device (5 pins)
Vs_out: core (J2.1 J2.2), device (R67.1)
485_A: core (F2.1), device (J7.12 J8.2 J9.1)
485_B: core (F1.1), device (J6.1 J7.11 R61.1)
AI1: core (C23.2 D1.2 U3.38), device (R25.2)
AI2: core (C24.2 D2.2 U3.39), device (R38.2)
BLE_RX: core (U3.6), device (U9.8)
BLE_TX: core (U3.7), device (U9.7)
DI5: core (U3.35), device (C36.2 D15.3 R44.1)
DI6: core (U3.36), device (C35.2 D16.3 R46.1)
PWM: core (U3.11), device (Q6.1 R57.1)
RP_DI5: core (J2.6), device (J4.2)
RP_DI6: core (J2.5), device (J5.2)
SCL0: core (U3.3), device (P1.2 R59.2 U11.10 U12.6)
SDA0: core (U3.2), device (P1.3 R58.2 U11.9 U12.5)
SPI_CLK: core (U3.29), device (D9.5)
SPI_DC: core (U3.31), device (D9.3)
SPI_MOSI: core (U3.30), device (D9.4)
SPI_RST: core (U3.32), device (D9.1)
TTL5_SDA1: core (U3.9), device (Q3.2 R18.2)
TTL6_SCL1: core (U3.8), device (Q4.2 R32.2)